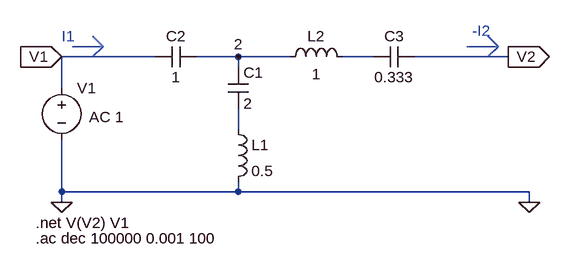
[diagram p0: schematic Ejercicio1.asc]
Ejercicio1.asc, the LTspice schematic file:
Version 4
SHEET 1 880 680
WIRE 128 -128 -16 -128
WIRE 256 -128 192 -128
WIRE 336 -128 256 -128
WIRE 464 -128 416 -128
WIRE 672 -128 528 -128
WIRE 256 -112 256 -128
WIRE -16 -80 -16 -128
WIRE 256 -16 256 -48
WIRE -16 80 -16 0
WIRE 256 80 256 64
WIRE 256 80 -16 80
WIRE 704 80 256 80
WIRE -16 96 -16 80
WIRE 704 96 704 80
FLAG 672 -128 V2
IOPIN 672 -128 Out
FLAG -16 -128 V1
IOPIN -16 -128 In
FLAG 704 96 0
FLAG -16 96 0
FLAG 256 -128 2
SYMBOL voltage -16 -96 R0
WINDOW 123 42 61 Left 2
WINDOW 39 0 0 Left 0
SYMATTR Value2 AC 1
SYMATTR InstName V1
SYMATTR Value ""
SYMBOL cap 240 -112 R0
SYMATTR InstName C1
SYMATTR Value 2
SYMBOL ind 240 -32 R0
SYMATTR InstName L1
SYMATTR Value 0.5
SYMBOL cap 192 -144 R90
WINDOW 0 0 32 VBottom 2
WINDOW 3 32 32 VTop 2
SYMATTR InstName C2
SYMATTR Value 1
SYMBOL ind 320 -112 R270
WINDOW 0 32 56 VTop 2
WINDOW 3 5 56 VBottom 2
SYMATTR InstName L2
SYMATTR Value 1
SYMBOL cap 528 -144 R90
WINDOW 0 0 32 VBottom 2
WINDOW 3 32 32 VTop 2
SYMATTR InstName C3
SYMATTR Value 0.333
TEXT -56 128 Left 2 !.net V(V2) V1
TEXT -56 152 Left 2 !.ac dec 100000 0.001 100
TEXT -16 -160 Left 2 ;I1
TEXT 616 -168 Left 2 ;-I2
LINE Normal 656 -144 608 -144
LINE Normal 640 -128 656 -144
LINE Normal 656 -144 640 -128
LINE Normal 640 -160 656 -144
LINE Normal 48 -144 0 -144
LINE Normal 32 -160 48 -144
LINE Normal 48 -144 32 -160
LINE Normal 32 -128 48 -144

The netlist it stands for:
* Ejercicio1.asc
V1 V1 0 AC 1
C1 2 N002 2
L1 N002 0 0.5
C2 2 V1 1
L2 2 N001 1
C3 V2 N001 0.333
.net V(V2) V1
.ac dec 100000 0.001 100
* I1
* -I2
.backanno
.end